# EAGLE design esp8266-programmer (EAGLE 6.4)
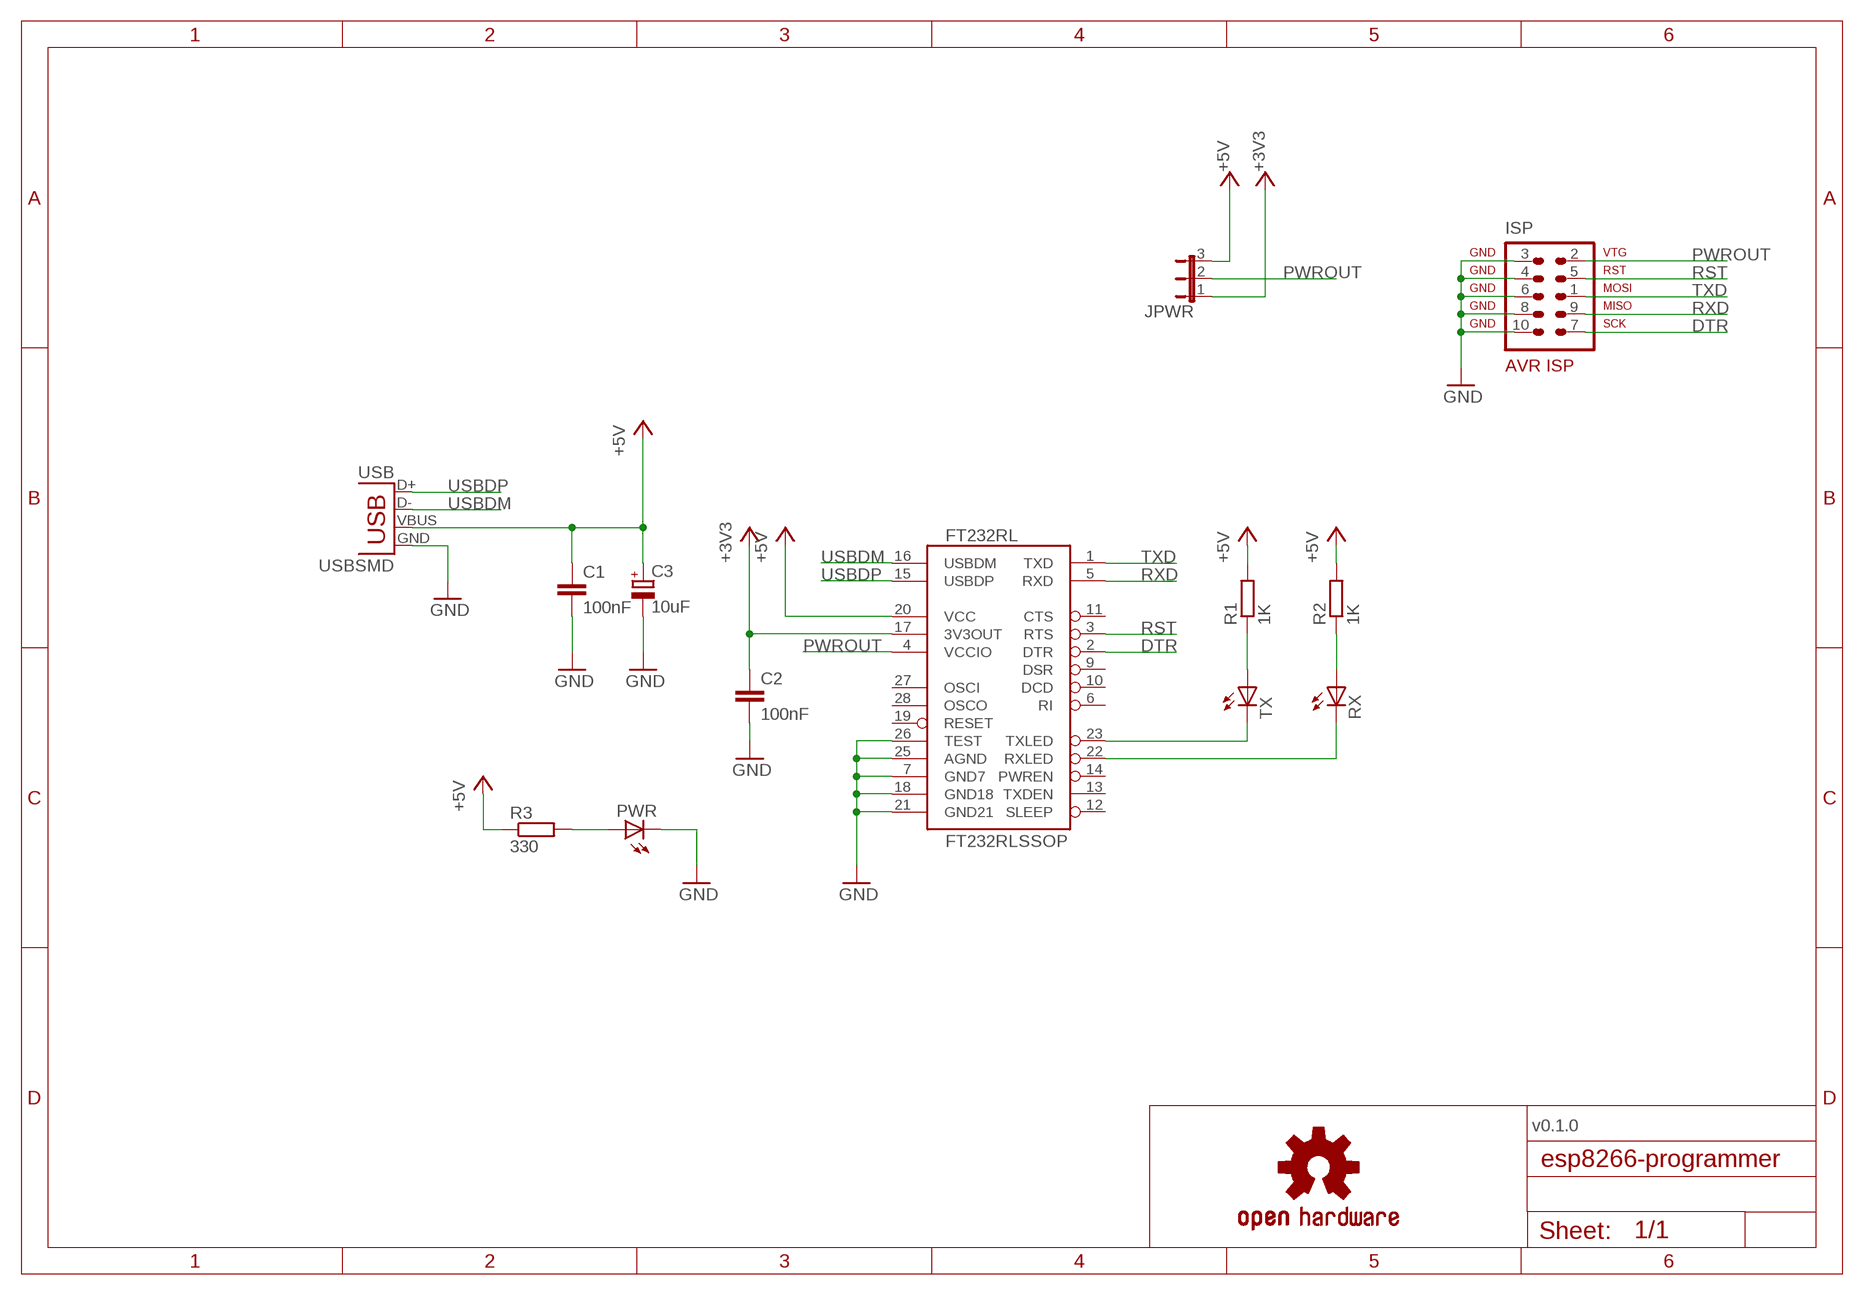
[diagram p0: schematic, sheet 1]

## Parts
C1  100nF  C-EUC0805  [C0805]
C2  100nF  C-EUC0805  [C0805]
C3  10uF  CPOL-EUA/3216-18W  [A/3216-18W]
FT232RL  FT232RLSSOP  [SSOP28DB]
ISP  AVR-ISP-10ML  [ML10]
JPWR  JP2E  [JP2]
LOGO1  OSHW-LOGOL  [OSHW-LOGO-L]
PWR  LEDSML0805  [SML0805]
R1  1K  R-EU_R0805  [R0805]
R2  1K  R-EU_R0805  [R0805]
R3  330  R-EU_R0805  [R0805]
RX  LEDSML0805  [SML0805]
TX  LEDSML0805  [SML0805]
USB  USBSMD  [USB-MINIB]

## Nets
+3V3: C2.1 FT232RL.17(3V3OUT) JPWR.1
+5V: C1.1 C3.+ FT232RL.20(VCC) JPWR.3 R1.2 R2.2 R3.1 USB.VBUS
DTR: FT232RL.2(DTR) ISP.7
GND: C1.2 C2.2 C3.- FT232RL.7(GND7) FT232RL.18(GND18) FT232RL.21(GND21) FT232RL.25(AGND) FT232RL.26(TEST) ISP.3 ISP.4 ISP.6 ISP.8 ISP.10 PWR.C USB.GND
N$1: PWR.A R3.2
N$2: R1.1 TX.A
N$3: R2.1 RX.A
PWROUT: FT232RL.4(VCCIO) ISP.2 JPWR.2
RST: FT232RL.3(RTS) ISP.5
RX: FT232RL.22(RXLED) RX.C
RXD: FT232RL.5(RXD) ISP.9
TX: FT232RL.23(TXLED) TX.C
TXD: FT232RL.1(TXD) ISP.1
USBDM: FT232RL.16(USBDM) USB.D-
USBDP: FT232RL.15(USBDP) USB.D+
Unconnected: FT232RL.6(RI) FT232RL.9(DSR) FT232RL.10(DCD) FT232RL.11(CTS) FT232RL.12(SLEEP) FT232RL.13(TXDEN) FT232RL.14(PWREN) FT232RL.19(RESET) FT232RL.27(OSCI) FT232RL.28(OSCO)

## Notes on the sheet
- v0.1.0

## Library data of the parts
C1 C2 = rcl:C-EU: CAPACITOR, European symbol
C3 = rcl:CPOL-EU: POLARIZED CAPACITOR, European symbol
FT232RL = SparkFun-DigitalIC:FT232RL: USB UART FT232RL 4th Generation USB UART (USB <-> Serial) Controller. Spark Fun Electronics SKU : COM-00650 Production SKU IC-00870; PROD_ID: IC-00870
ISP = atmel-1:AVR-ISP-10: AVR ISP-10 Serial Programming Header
JPWR = jumper:JP2E: JUMPER
LOGO1 = SparkFun-Aesthetics:OSHW-LOGO: Open Source Hardware Logo This logo indicates the piece of hardware it is found on incorporates a OSHW license and/or adheres to the definition of open source hardware found here: http://freedomdefined.org/OSHW
PWR RX TX = led:LED: LED OSRAM: - CHIPLED LG R971, LG N971, LY N971, LG Q971, LY Q971, LO R971, LY R971 LH N974, LH R974 LS Q976, LO Q976, LY Q976 LO Q996 - Hyper CHIPLED LW Q18S LB Q993, LB Q99A, LB R99A - SideLED LS A670, LO A670, LY A670, LG A670, LP A670 LB A673, LV A673, LT A673, LW A673 LH A674 LY A675 LS A676, LA A676, LO A676, LY A676, LW A676 LS A679, LY A679, LG A679 - Hyper Micro SIDELED® LS Y876, LA Y876, LO Y876, LY Y876 LT Y87S - SmartLED LW L88C, LW L88S LB L89C, LB L89S, LG L890 LS L89K, LO L89K, LY L89K LS L896, LA L896, LO L896, LY L896 - TOPLED LS T670, LO T670, LY T670, LG T670, LP T670 LSG T670, LSP T670, LSY T670, LOP T670, LYG T670 LG T671, LOG T671, LSG T671 LB T673, LV T673, LT T673, LW T673 LH T674 LS T676, LA T676, LO T676, LY T676, LB T676, LH T676, LSB T676, LW T676 LB T67C, LV T67C, LT T67C, LS T67K, LO T67K, LY T67K, LW E67C LS E67B, LA E67B, LO E67B, LY E67B, LB E67C, LV E67C, LT E67C LW T67C LS T679, LY T679, LG T679 LS T770, LO T770, LY T770, LG T770, LP T770 LB T773, LV T773, LT T773, LW T773 LH T774 LS E675, LA E675, LY E675, LS T675 LS T776, LA T776, LO T776, LY T776, LB T776 LHGB T686 LT T68C, LB T68C - Hyper Mini TOPLED® LB M676 - Mini TOPLED Santana® LG M470 LS M47K, LO M47K, LY M47K Source: http://www.osram.convergy.de LUXEON: - LUMILED® LXK2-PW12-R00, LXK2-PW12-S00, LXK2-PW14-U00, LXK2-PW14-V00 LXK2-PM12-R00, LXK2-PM12-S00, LXK2-PM14-U00 LXK2-PE12-Q00, LXK2-PE12-R00, LXK2-PE12-S00, LXK2-PE14-T00, LXK2-PE14-U00 LXK2-PB12-K00, LXK2-PB12-L00, LXK2-PB12-M00, LXK2-PB14-N00, LXK2-PB14-P00, LXK2-PB14-Q00 LXK2-PR12-L00, LXK2-PR12-M00, LXK2-PR14-Q00, LXK2-PR14-R00 LXK2-PD12-Q00, LXK2-PD12-R00, LXK2-PD12-S00 LXK2-PH12-R00, LXK2-PH12-S00 LXK2-PL12-P00, LXK2-PL12-Q00, LXK2-PL12-R00 Source: www.luxeon.com KINGBRIGHT: KA-3528ASYC Source: www.kingbright.com
R1-R3 = rcl:R-EU_: RESISTOR, European symbol
USB = SparkFun-Connectors:USB: USB Connectors USB-B-PTH is fully proven SKU : PRT-00139/CONN-08278 USB-miniB is fully proven SKU : PRT-00587 USB-A-PCB is untested. USB-A-H is throughly reviewed, but untested. Spark Fun Electronics SKU : PRT-00437 USB-B-SMT is throughly reviewed, but untested. Needs silkscreen touching up. USB-A-S has not been used/tested USB-MB-H has not been used/tested USB-MICROB has been used. CONN-09505; PROD_ID: CONN-08193

## Board
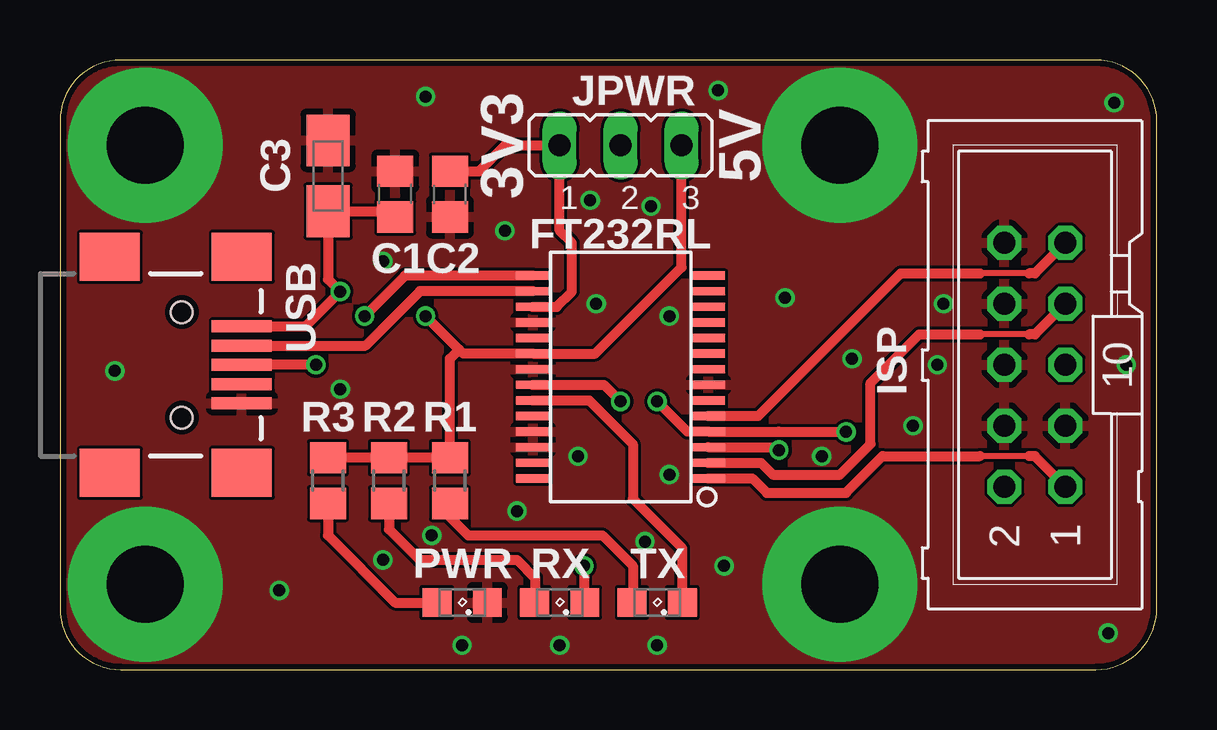
[diagram p1: board, top side]
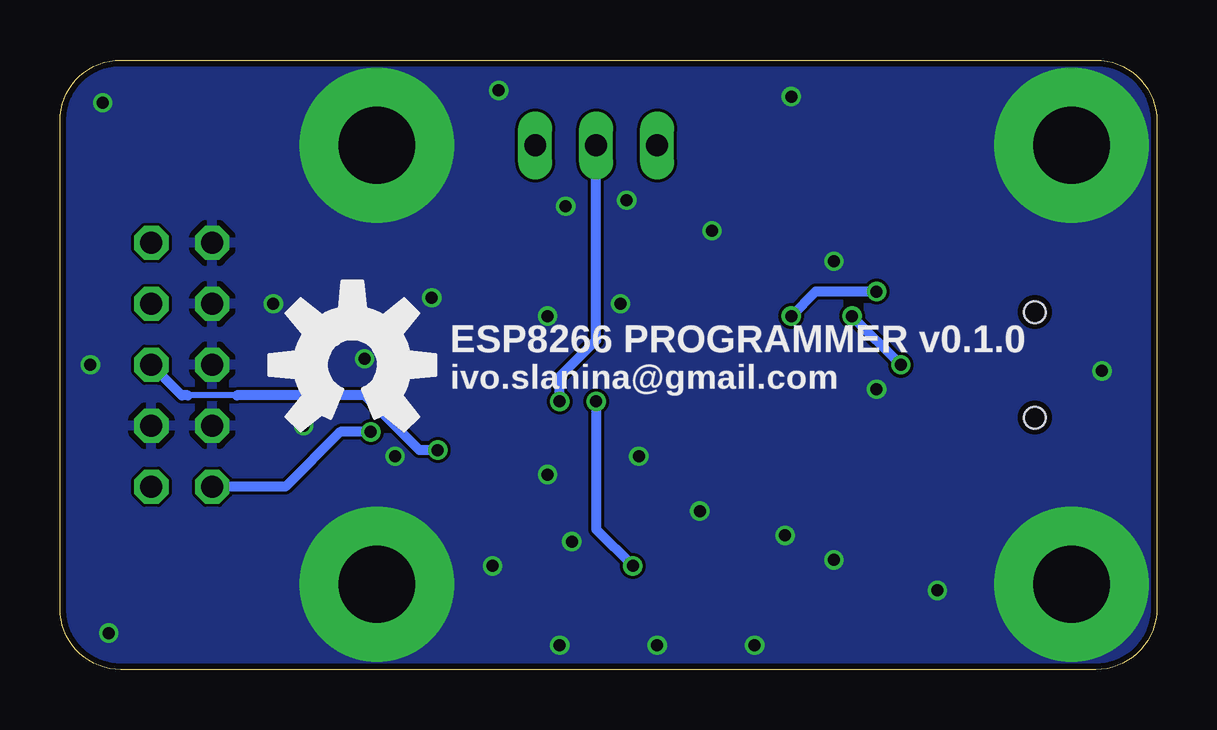
[diagram p2: board, bottom side, seen from below]

Size 45.72 x 25.4 mm. Coordinates in mm from the lower left corner, seen from the top.
Outline: 2.54,0 43.18,0 arc90 45.72,2.54 45.72,22.86 arc90 43.18,25.4 2.54,25.4 arc90 0,22.86 0,2.54 arc90 2.54,0
Copper layers (1*16): Top 0.035mm / dielectric 1.5mm / Bottom 0.035mm
Design rules "dirt_cheap_dirty_boards.v1": minimum track width 5mil, minimum drill 12mil, track to track 5mil, track to pad 5mil, pad to pad 5mil, via to via 5mil, smd to smd 0mil, copper to edge 10mil, drill to drill 10mil, minimum pad ring 10mil, minimum via ring 6mil, stop-mask expansion 2mil, vias tented up to drill 25mil, thermal gap 10mil

### Footprints (pad centres in the part's own frame; a part is rotated, then mirrored left to right if it is on the bottom)
C0805 = smd 1.3 x 1.5: 1 -0.95,0; 2 0.95,0
A/3216-18W = smd 2.15 x 1.8: + 1.475,0; - -1.475,0
SSOP28DB = smd 0.348 x 1.397: 1 -4.225,-3.656; 2 -3.575,-3.656; 3 -2.925,-3.656; 4 -2.275,-3.656; 5 -1.625,-3.656; 6 -0.975,-3.656; 7 -0.325,-3.656; 8 0.325,-3.656; 9 0.975,-3.656; 10 1.625,-3.656; 11 2.275,-3.656; 12 2.925,-3.656; 13 3.575,-3.656; 14 4.225,-3.656; 15 4.225,3.656; 16 3.575,3.656; 17 2.925,3.656; 18 2.275,3.656; 19 1.625,3.656; 20 0.975,3.656; 21 0.325,3.656; 22 -0.325,3.656; 23 -0.975,3.656; 24 -1.625,3.656; 25 -2.275,3.656; 26 -2.925,3.656; 27 -3.575,3.656; 28 -4.225,3.656
ML10 = drill 0.914 octagon: 1 -5.08,-1.27; 2 -5.08,1.27; 3 -2.54,-1.27; 4 -2.54,1.27; 5 0,-1.27; 6 0,1.27; 7 2.54,-1.27; 8 2.54,1.27; 9 5.08,-1.27; 10 5.08,1.27
JP2 = drill 0.914 long: 1 -2.54,0; 2 0,0; 3 2.54,0
SML0805 = smd 1.2 x 1.2: A 1.05,0; C -1.05,0
R0805 = smd 1.3 x 1.5: 1 -0.95,0; 2 0.95,0
USB-MINIB = smd 2.5 x 0.5: D+ 2.5,0; D- 2.5,0.8; GND 2.5,-1.6; ID 2.5,-0.8; VBUS 2.5,1.6 | smd 2.5 x 2: MTN1 -3,4.5; MTN2 2.5,4.5; MTN3 -3,-4.5; MTN4 2.5,-4.5 | hole 0.9: 0,2.2; 0,-2.2

### Placement (x,y rotation side)
C1  13.97,19.81 90 top
C2  16.26,19.81 270 top
C3  11.18,20.57 270 top
FT232RL  23.37,12.19 90 top
ISP  40.64,12.7 90 top
JPWR  23.37,21.84 0 top
LOGO1  33.53,12.7 0 bottom
PWR  16.76,2.79 180 top
R1  16.26,7.87 90 top
R2  13.72,7.87 90 top
R3  11.18,7.87 270 top
RX  20.83,2.79 180 top
TX  24.89,2.79 180 top
USB  5.08,12.7 0 top

### Tracks (layer width: path | path; a pad name or v marks a point on that pad's centre or on a via)
+3V3
  Top 0.406: FT232RL.17 20.7,15.12 21.34,15.75 21.34,17.78 20.83,18.29 JPWR.1 18.54,21.84 17.46,20.76 C2.1
+5V  (via drill 0.5)
  Top 0.406: USB.VBUS 10.24,14.3 v11.68,15.75 11.18,16.26 C3.+ 13.97,19.1 C1.1 | 16.64,13.34 16.8,13.17 FT232RL.20 22.31,13.17 25.91,16.76 JPWR.3 | 16.64,13.34 v15.24,14.73 | 16.64,13.34 16.26,12.95 R1.2 R2.2 R3.1
  Bottom 0.406: v11.68,15.75 14.22,15.75 v15.24,14.73
DTR
  Top 0.254: 40.39,13.97 38.35,13.97
  Top 0.406: ISP.7 40.64,13.97 40.39,13.97 | FT232RL.2 29.23,8.62 29.72,8.13 32.51,8.13 33.78,9.4 33.78,11.94 35.81,13.97 38.35,13.97
GND  (via drill 0.5, 3.2 pad 6.45)
  other vias: 3.56,21.84 3.56,3.56 32.51,3.56 32.51,21.84 9.14,3.3 18.54,18.29 15.24,23.88 22.35,15.24 25.4,14.73 30.23,15.49 21.59,8.89 25.4,8.13 11.68,11.68 2.29,12.45 13.46,4.57 19.05,6.6 27.69,4.32 35.56,10.16 36.58,12.7 36.83,15.24 33.02,12.95 24.64,19.3 22.1,19.56 27.43,24.13 16.76,1.02 20.83,1.02 24.89,1.02 24.38,5.33 13.46,17.02 43.94,23.62 43.69,1.52 44.45,12.7 15.49,5.59 31.75,8.89
  pour Bottom: -0.25,25.65 -0.25,-0.25 45.97,-0.25 45.97,25.65
  pour Top: -0.25,25.65 -0.25,-0.25 45.97,-0.25 45.97,25.65
N$1
  Top 0.406: R3.2 11.18,5.59 13.97,2.79 PWR.A
N$2
  Top 0.406: R1.1 16.26,6.35 17.02,5.59 22.61,5.59 23.88,4.32 23.88,2.83 TX.A
N$3
  Top 0.406: R2.1 13.72,5.84 14.99,4.57 19.05,4.57 19.81,3.81 19.81,2.83 RX.A
PWROUT  (via drill 0.5)
  Top 0.406: v32.77,9.91 29.96,9.92 FT232RL.4 26.15,9.92 v24.89,11.18
  Bottom 0.406: v32.77,9.91 34.04,9.91 36.32,7.62 ISP.2 | v24.89,11.18 24.89,12.19 23.37,13.72 JPWR.2
RST  (via drill 0.5)
  Top 0.406: FT232RL.3 29.85,9.27 v29.97,9.14
  Bottom 0.254: 38.35,11.43 40.39,11.43
  Bottom 0.406: v29.97,9.14 30.73,9.14 33.02,11.43 38.35,11.43 | 40.39,11.43 40.64,11.43 ISP.5
RX  (via drill 0.5)
  Top 0.406: FT232RL.22 22.68,11.87 v23.37,11.18 | v21.84,4.32 21.84,2.83 RX.C
  Bottom 0.406: v23.37,11.18 23.37,5.84 v21.84,4.32
RXD
  Top 0.254: 40.39,16.51 38.35,16.51
  Top 0.406: ISP.9 40.64,16.51 40.39,16.51 | FT232RL.5 29.11,10.57 35.05,16.51 38.35,16.51
TX
  Top 0.406: TX.C 25.94,5.05 23.88,7.11 23.88,9.4 22.06,11.22 FT232RL.23
TXD
  Top 0.254: 40.39,8.89 38.35,8.89
  Top 0.406: ISP.1 40.64,8.89 40.39,8.89 | FT232RL.1 28.86,7.97 29.46,7.37 32.77,7.37 34.29,8.89 38.35,8.89
USBDM
  Top 0.406: USB.D- 12.74,13.5 15.01,15.77 FT232RL.16
USBDP  (via drill 0.5)
  Top 0.406: FT232RL.15 14.38,16.42 v12.7,14.73 | v10.67,12.7 USB.D+
  Bottom 0.406: v12.7,14.73 v10.67,12.7

### Text on the board
bPlace: ESP8266 PROGRAMMER v0.1.0 | ivo.slanina@gmail.com
tNames: 3V3 | 5V